# EAGLE schematic mg5001dev-1.0p10 (EAGLE 4.11)
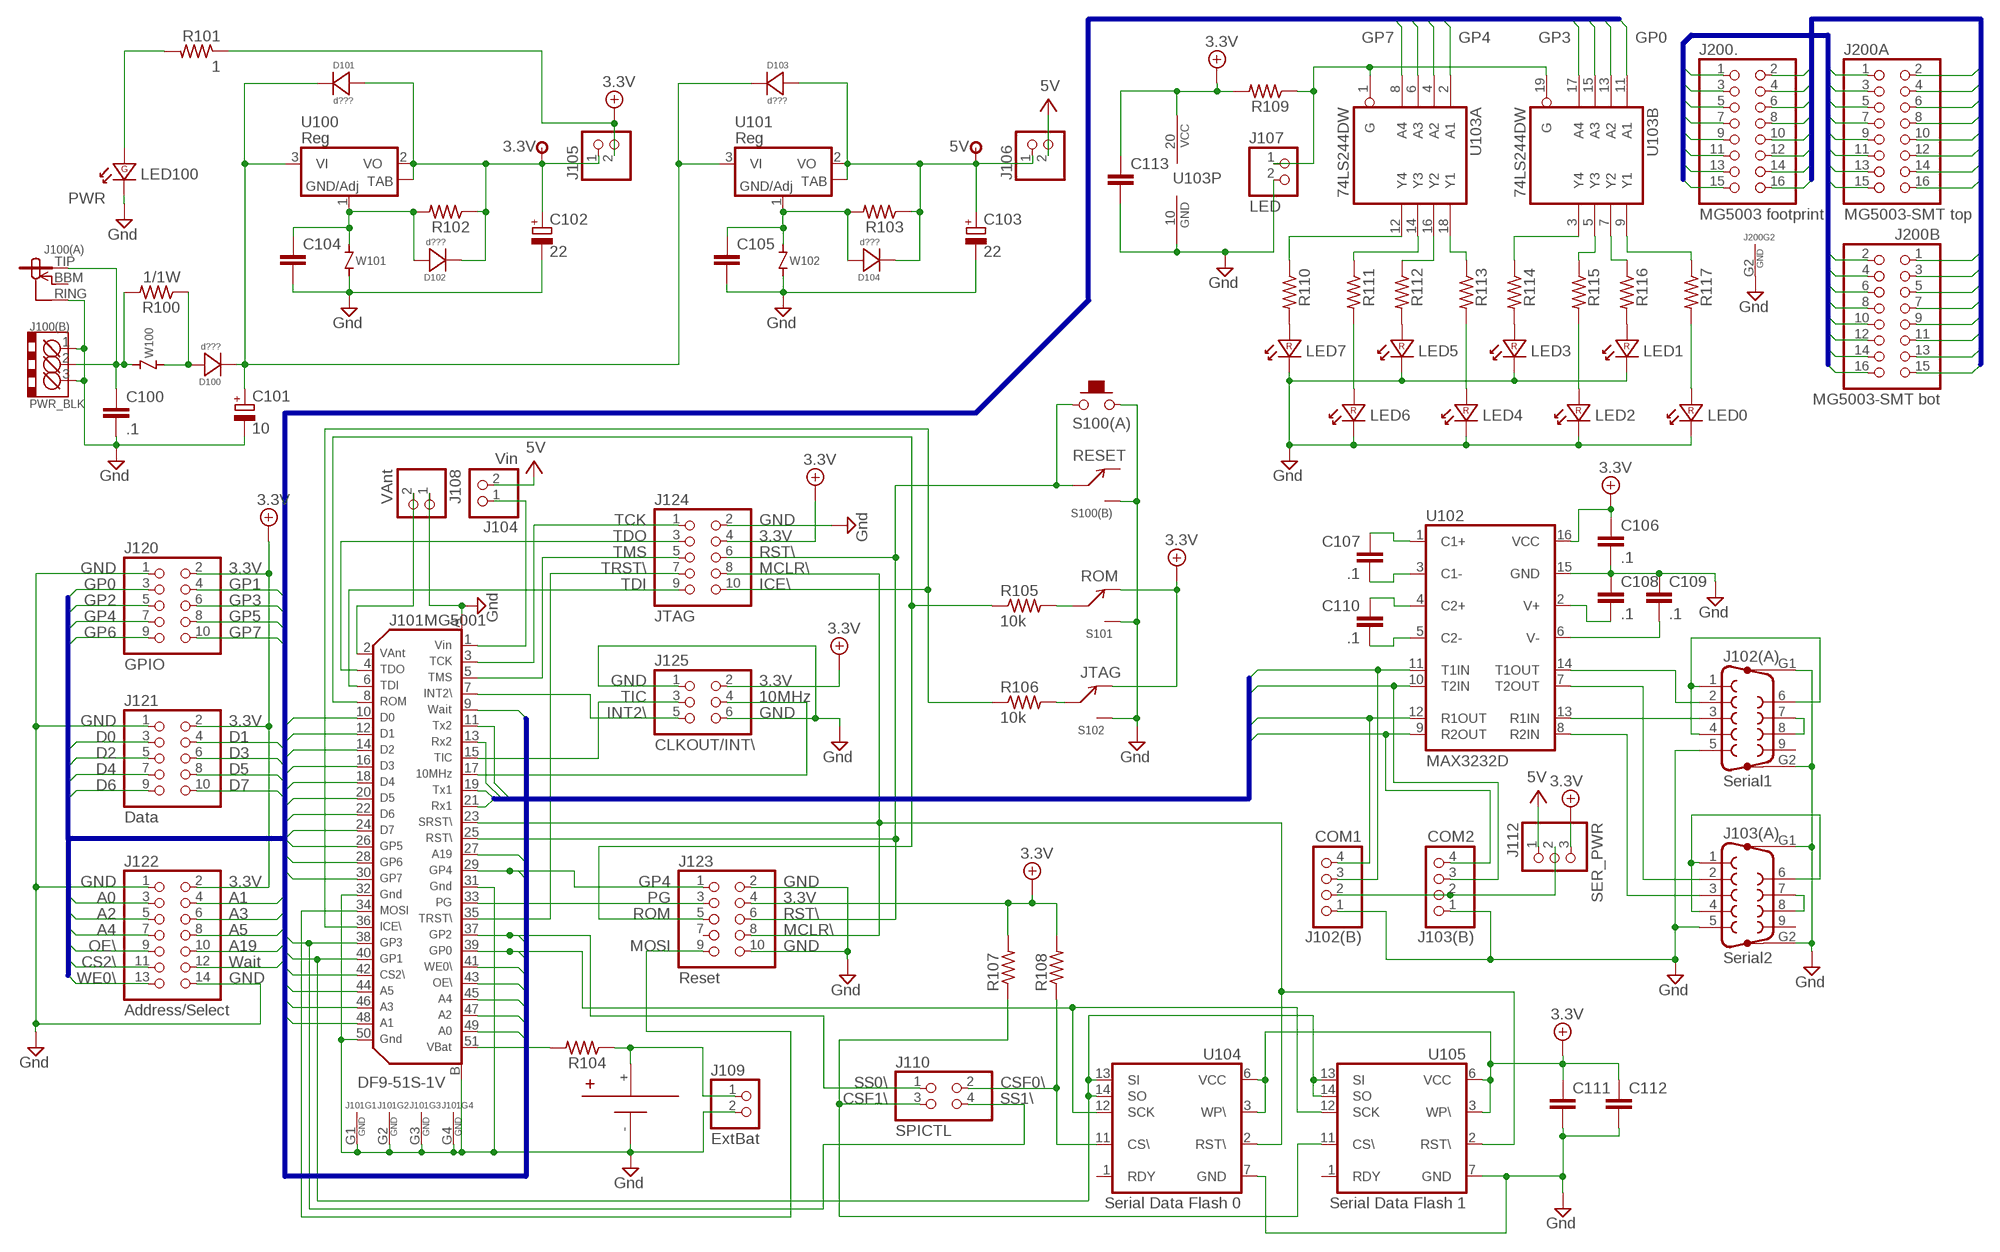
[diagram p0: schematic, sheet 1]

## Parts
3.3V  PAD_0.1'-042  [PAD_ROUND_APC-FREE_0.1/042]
5V  PAD_0.1'-042  [PAD_ROUND_APC-FREE_0.1/042]
B100  BATTERY_COIN_20MM_CR2032  [MEMORY_PROTECTION_DEVICES_BH32T_20MM_COIN_CELL_HOLDER]
C100  .1  C-EUC1206  [C1206]
C101  10  CAP-POL-ELECTROLYTIC-7342-31  [EIA-7343-31]
C102  22  CAP-POL-ELECTROLYTIC-6032-28  [EIA-6032-28]
C103  22  CAP-POL-ELECTROLYTIC-6032-28  [EIA-6032-28]
C104  C-EUC1206  [C1206]
C105  C-EUC1206  [C1206]
C106  .1  C-EUC0805  [C0805]
C107  .1  C-EUC0805  [C0805]
C108  .1  C-EUC0805  [C0805]
C109  .1  C-EUC0805  [C0805]
C110  .1  C-EUC0805  [C0805]
C111  C-EUC1206  [C1206]
C112  C-EUC1206  [C1206]
C113  C-EUC1206  [C1206]
D100  d???  DIODE_SMT_SCHOTTKY-1.0A-SMA  [SMA-DIODE]
D101  d???  DIODE_SMT_SCHOTTKY-1.0A-SMA  [SMA-DIODE]
D102  d???  DIODE_SMT_SCHOTTKY-1.0A-SMA  [SMA-DIODE]
D103  d???  DIODE_SMT_SCHOTTKY-1.0A-SMA  [SMA-DIODE]
D104  d???  DIODE_SMT_SCHOTTKY-1.0A-SMA  [SMA-DIODE]
J100(A)  PWR  CONN_PWR_COAXIAL_2.1MM  [SWITCHCRAFT-2.1MM-COAXIAL-POWER]
J100(B)  PWR_BLK  CONN_EUROBLOCK_0.1X3  [EUROBLOCK-2.54-X3]
J101  DF9-51S-1V  FOOTPRINT_MG5001  [MG5001-FOOTPRINT]
J102(A)  Serial1  F09HP  [F09HP]
J102(B)  COM1  PINHD-1X4  [1X04]
J103(A)  Serial2  F09HP  [F09HP]
J103(B)  COM2  PINHD-1X4  [1X04]
J104  Vin  PINHD-1X2  [1X02]
J105  PINHD-1X2  [1X02]
J106  PINHD-1X2  [1X02]
J107  LED  PINHD-1X2  [1X02]
J108  VAnt  PINHD-1X2  [1X02]
J109  ExtBat  PINHD-1X2  [1X02]
J110  SPICTL  PINHD-2X2  [2X02]
J112  SER_PWR  PINHD-1X3  [1X03]
J120  GPIO  PINHD-2X5  [2X05]
J121  Data  PINHD-2X5  [2X05]
J122  Address/Select  PINHD-2X7  [2X07]
J123  Reset  PINHD-2X5  [2X05]
J124  JTAG  PINHD-2X5  [2X05]
J125  CLKOUT/INT\  PINHD-2X3  [2X03]
J200  MG5003 footprint  FOOTPRINT_MG5003-1HOLE  [MG5003-FOOTPRINT-ONE_HOLE]
J200A  MG5003-SMT top  CONN_2MM-2X8-SMT  [2MM-2X8-SMT]
J200B  MG5003-SMT bot  CONN_2MM-2X8-SMT  [2MM-2X8-SMT]
LED0  LED-RED-0603  [0603-DIODE]
LED1  LED-RED-0603  [0603-DIODE]
LED2  LED-RED-0603  [0603-DIODE]
LED3  LED-RED-0603  [0603-DIODE]
LED4  LED-RED-0603  [0603-DIODE]
LED5  LED-RED-0603  [0603-DIODE]
LED6  LED-RED-0603  [0603-DIODE]
LED7  LED-RED-0603  [0603-DIODE]
LED100  LED-GRN-  [0603-DIODE]
R100  1/1W  R-US_R2512  [R2512]
R101  1  R-US_R1206  [R1206]
R102  R-US_R1206  [R1206]
R103  R-US_R1206  [R1206]
R104  R-US_R1206  [R1206]
R105  10k  R-US_R0805  [R0805]
R106  10k  R-US_R0805  [R0805]
R107  R-US_R1206  [R1206]
R108  R-US_R1206  [R1206]
R109  R-US_R1206  [R1206]
R110  R-US_R0805  [R0805]
R111  R-US_R0805  [R0805]
R112  R-US_R0805  [R0805]
R113  R-US_R0805  [R0805]
R114  R-US_R0805  [R0805]
R115  R-US_R0805  [R0805]
R116  R-US_R0805  [R0805]
R117  R-US_R0805  [R0805]
S100(A)  Reset  SW_MOMENTARY-6X3.5MM  [SW_6X3.5MM]
S100(B)  SW_0.1-SPDT  [0.1_IN_HEADER_FOR_SWITCH]
S101  SW_0.1-SPDT  [0.1_IN_HEADER_FOR_SWITCH]
S102  SW_0.1-SPDT  [0.1_IN_HEADER_FOR_SWITCH]
U100  Reg  IC_REG_3TERM+TAB=VOUT  [TO263/D2PAK-3]
U101  Reg  IC_REG_3TERM+TAB=VOUT  [TO263/D2PAK-3]
U102  MAX3232D  IC_MAX3232D  [SO16]
U103  74LS244DW  [SO20W]
U104  Serial Data Flash 0  IC_MEM_AT45DBX-TC  [TSOP-28-8X13.4]
U105  Serial Data Flash 1  IC_MEM_AT45DBX-TC  [TSOP-28-8X13.4]
W100  R9  JUMPER_ZEROOHM1206  [ZJ-1206]
W101  R9  JUMPER_ZEROOHM1206  [ZJ-1206]
W102  R9  JUMPER_ZEROOHM1206  [ZJ-1206]

## Nets
3.3V: C106.1 C111.1 C112.1 C113.1 J105.2 J112.3 J120.2 J121.2 J122.2 J123.4 J124.4 J125.2 R101.1 R107.2 R108.2 R109.2 S101.LEFT(NC) S102.LEFT(NC) U102.16(VCC) U103.20(P:VCC) U104.3(WP\) U104.6(VCC) U105.3(WP\) U105.6(VCC)
3.3V-SUP: 3.3V.PAD C102.+ D101.1(ANODE)(ANODE) D102.2(CATHODE)(CATHODE) J105.1 R102.1 U100.2(VO) U100.TAB
5V: J104.2 J106.2 J112.1
5V-SUP: 5V.PAD C103.+ D103.1(ANODE)(ANODE) D104.2(CATHODE)(CATHODE) J106.1 R103.1 U101.2(VO) U101.TAB
10MHZ: J101.17 J125.4
A0: J101.49 J122.3
A1: J101.48 J122.4
A2: J101.47 J122.5
A3: J101.46 J122.6
A4: J101.45 J122.7
A5: J101.44 J122.8
A19: J101.27 J122.10
C1+: C107.1 U102.1(C1+)
C1-: C107.2 U102.3(C1-)
C2+: C110.1 U102.4(C2+)
C2-: C110.2 U102.5(C2-)
CS2\: J101.42 J122.11
CSF0\: J110.2 R108.1 U104.11(CS\)
CSF1\: J110.3 R107.1 U105.11(CS\)
CV+: C108.2 U102.2(V+)
CV-: C109.2 U102.6(V-)
D0: J101.10 J121.3
D1: J101.12 J121.4
D2: J101.14 J121.5
D3: J101.16 J121.6
D4: J101.18 J121.7
D5: J101.20 J121.8
D6: J101.22 J121.9
D7: J101.24 J121.10
DSR/DTR/DCD-1: J102(A).1 J102(A).4 J102(A).6
DSR/DTR/DCD-2: J103(A).1 J103(A).4 J103(A).6
GND: B100.-(B-) C100.2 C101.- C102.- C103.- C104.2 C105.2 C106.2 C108.1 C109.1 C111.2 C112.2 C113.2 J100(A).RING J100(B).1 J100(B).3 J101.31 J101.32 J101.50 J101.A(MG5001:A) J101.B(MG5001:B) J101.G1(GND) J101.G2(GND) J101.G3(GND) J101.G4(GND) J102(A).5 J102(A).G1 J102(A).G2 J102(B).1 J103(A).5 J103(A).G1 J103(A).G2 J103(B).1 J107.2 J108.1 J109.2 J120.1 J121.1 J122.1 J122.14 J123.2 J123.10 J124.2 J125.1 J125.6 J200.G2(GND) LED0.K(CATHODE) LED1.K(CATHODE) LED2.K(CATHODE) LED3.K(CATHODE) LED4.K(CATHODE) LED5.K(CATHODE) LED6.K(CATHODE) LED7.K(CATHODE) LED100.K(CATHODE) S100(A).2 S100(B).RIGHT(NO) S101.RIGHT(NO) S102.RIGHT(NO) U102.15(GND) U103.10(P:GND) U104.7(GND) U105.7(GND) W101.2 W102.2 ; supply symbol labelled Gnd
GP0: J101.39 J120.3 U103.11(B:A1) U104.12(SCK) U105.12(SCK)
GP1: J101.40 J120.4 U103.13(B:A2) U104.13(SI) U104.14(SO) U105.13(SI) U105.14(SO)
GP2: J101.37 J110.1 J120.5 U103.15(B:A3)
GP3: J101.38 J110.4 J120.6 U103.17(B:A4)
GP4: J101.29 J120.7 J123.1 U103.2(A:A1)
GP5: J101.26 J120.8 U103.4(A:A2)
GP6: J101.28 J120.9 U103.6(A:A3)
GP7: J101.30 J120.10 U103.8(A:A4)
ICE\: J101.36 J124.10 R106.1
ICE_SUGGEST: R106.2 S102.CENTER(COM)
INT2\: J101.7 J125.5
LED_ANODE0: LED7.A(ANODE) R110.2
LED_ANODE1: LED6.A(ANODE) R111.2
LED_ANODE2: LED5.A(ANODE) R112.2
LED_ANODE3: LED4.A(ANODE) R113.2
LED_ANODE4: LED3.A(ANODE) R114.2
LED_ANODE5: LED2.A(ANODE) R115.2
LED_ANODE6: LED1.A(ANODE) R116.2
LED_ANODE7: LED0.A(ANODE) R117.2
LED_DRIVE0: R110.1 U103.12(A:Y4)
LED_DRIVE1: R111.1 U103.14(A:Y3)
LED_DRIVE2: R112.1 U103.16(A:Y2)
LED_DRIVE3: R113.1 U103.18(A:Y1)
LED_DRIVE4: R114.1 U103.3(B:Y4)
LED_DRIVE5: R115.1 U103.5(B:Y3)
LED_DRIVE6: R116.1 U103.7(B:Y2)
LED_DRIVE7: R117.1 U103.9(B:Y1)
LED_ENABLE: J107.1 R109.1 U103.1(A:G) U103.19(B:G)
MCLR\: J101.23 J123.8 J124.8 U104.2(RST\) U105.2(RST\)
MOSI: J101.34 J123.9
OE\: J101.43 J122.9
PG: J101.33 J123.3
PWR: C100.1 J100(A).TIP J100(B).2 R100.2 W100.1
PWR_FILTERED: D100.1(ANODE)(ANODE) R100.1 W100.2
PWR_LAMP: LED100.A(ANODE) R101.2
ROM: J101.8 J123.5 R105.1
ROM_SUGGEST: R105.2 S101.CENTER(COM)
RS232-RX1: J102(A).3 U102.13(R1IN)
RS232-RX2: J103(A).3 U102.8(R2IN)
RS232-TX1: J102(A).2 U102.14(T1OUT)
RS232-TX2: J103(A).2 U102.7(T2OUT)
RST\: J101.25 J123.6 J124.6 S100(A).1 S100(B).CENTER(COM)
RTS/CTS-1: J102(A).7 J102(A).8
RTS/CTS-2: J103(A).7 J103(A).8
RX1: J101.21 J102(B).4 U102.12(R1OUT)
RX2: J101.13 J103(B).4 U102.9(R2OUT)
SER_PWR: J102(B).2 J103(B).2 J112.2
TCK: J101.3 J124.1
TDI: J101.6 J124.9
TDO: J101.4 J124.3
TIC: J101.15 J125.3
TMS: J101.5 J124.5
TRST\: J101.35 J124.7
TX1: J101.19 J102(B).3 U102.11(T1IN)
TX2: J101.11 J103(B).3 U102.10(T2IN)
VADJ-3.3: C104.1 D102.1(ANODE)(ANODE) R102.2 U100.1(GND) W101.1
VADJ-5: C105.1 D104.1(ANODE)(ANODE) R103.2 U101.1(GND) W102.1
VANT: J101.2 J108.2
VB: B100.+(B+) J109.1 R104.1
VBAT: J101.51 R104.2
VIN: J101.1 J104.1
VSUP: C101.+ D100.2(CATHODE)(CATHODE) D101.2(CATHODE)(CATHODE) D103.2(CATHODE)(CATHODE) U100.3(VI) U101.3(VI)
WAIT: J101.9 J122.12
WE0\: J101.41 J122.13
X1: J200.1 J200A.1 J200B.2
X2: J200.2 J200A.2 J200B.1
X3: J200.3 J200A.3 J200B.4
X4: J200.4 J200A.4 J200B.3
X5: J200.5 J200A.5 J200B.6
X6: J200.6 J200A.6 J200B.5
X7: J200.7 J200A.7 J200B.8
X8: J200.8 J200A.8 J200B.7
X9: J200.9 J200A.9 J200B.10
X10: J200.10 J200A.10 J200B.9
X11: J200.11 J200A.11 J200B.12
X12: J200.12 J200A.12 J200B.11
X13: J200.13 J200A.13 J200B.14
X14: J200.14 J200A.14 J200B.13
X15: J200.15 J200A.15 J200B.16
X16: J200.16 J200A.16 J200B.15
Unconnected: J100(A).BBM J102(A).9 J103(A).9 J123.7 S100(B).LEFT(NC) U104.1(RDY) U105.1(RDY)

## Buses
SERIAL:TX1,RX1,TX2,RX2
PARALLEL:A0,A1,A2,A3,A4,A5,A19,OE\,CS2\,WE0\,WAIT,D0,D1,D2,D3,D4,D5,D6,D7,GP0,GP1,GP2,GP3,GP4,GP5,GP6,GP7
XEVEN:X2,X4,X6,X8,X10,X12,X14,X16
XODD:X1,X3,X5,X7,X9,X11,X13,X15

## Notes on the sheet
- GP7 | GP4 | GP3 | GP0
- PWR
- RESET
- TCK | GND
- TDO | 3.3V
- TMS | RST\
- GND | 3.3V | TRST\ | MCLR\
- ROM
- GP0 | GP1 | TDI | ICE\
- GP2 | GP3
- GP4 | GP5
- GP6 | GP7
- JTAG
- GND | 3.3V
- TIC | 10MHz
- INT2\ | GND
- GND | 3.3V
- D0 | D1
- D2 | D3
- D4 | D5
- D6 | D7
- GND | 3.3V | GP4 | GND
- A0 | A1 | PG | 3.3V
- A2 | A3 | ROM | RST\
- A4 | A5 | MCLR\
- OE\ | A19 | MOSI | GND
- CS2\ | Wait
- WE0\ | GND
- SS0\ | CSF0\
- CSF1\ | SS1\

## Library data of the parts
3.3V 5V = psas_eagle_library:PAD_0.1
B100 = psas_eagle_library:BATTERY_COIN_20MM_CR2032: Memory Power Devices 20mm coin cell holder BH32T
C100 C104-C113 = rcl:C-EU: CAPACITOR, European symbol
C101-C103 = psas_eagle_library:CAP-POL-ELECTROLYTIC
D100-D104 = psas_eagle_library:DIODE_SMT_SCHOTTKY-1.0A
J100(A) = psas_eagle_library:CONN_PWR_COAXIAL_2.1MM
J100(B) = psas_eagle_library:CONN_EUROBLOCK_0.1X3: Euro-Style Terminal block 0.1" centers, 3 connectors
J101 = psas_eagle_library:FOOTPRINT_MG5001: Complete footprint for MG5001 OEM GPS board. lncludes 51 pin connector, mounting holes, and board outline.
J102(A) J103(A) = con-subd:F09HP: SUB-D
J102(B) J103(B) = pinhead:PINHD-1X4: PIN HEADER
J104-J109 = pinhead:PINHD-1X2: PIN HEADER
J110 = pinhead:PINHD-2X2: PIN HEADER
J112 = pinhead:PINHD-1X3: PIN HEADER
J120 J121 J123 J124 = pinhead:PINHD-2X5: PIN HEADER
J122 = pinhead:PINHD-2X7: PIN HEADER
J125 = pinhead:PINHD-2X3: PIN HEADER
J200 = psas_eagle_library:FOOTPRINT_MG5003-1HOLE
J200A J200B = psas_eagle_library:CONN_2MM-2X8-SMT
LED0 LED1-LED7 = psas_eagle_library:LED-RED-?: Red LED
LED100 = psas_eagle_library:LED-GRN-?
R100-R117 = rcl:R-US_: RESISTOR, American symbol
S100(A) = psas_eagle_library:SW_MOMENTARY: Momentary push button
S100(B) S101 S102 = psas_eagle_library:SW_0.1-SPDT
U100 U101 = psas_eagle_library:IC_REG_3TERM+TAB=VOUT: Three Terminal Linear Regulator w/TAB connected to VOUT The metal heat sink TAB on many regulators is electrically active. Effectively these are 4-terminal devices with 2 pins internally connected. I don't know of a way to express internal device connections in Eagle (devices have pins, but not nets), so this device is provided as a "reminder" to connect VOUT to TAB on the schematic. (Compare the IC_REG_3TERM+TAB=GND device.)
U102 = psas_eagle_library:IC_MAX3232: RS232 Dual Transciever
U103 = 74xx-us:74*244: Octal BUFFER and LINE DRIVER, 3-state
U104 U105 = psas_eagle_library:IC_MEM_AT45DBX*: Serial DataFlash
W100-W102 = psas_eagle_library:JUMPER_ZEROOHM: Cuttable surface mount jumper sized for surface mount devices